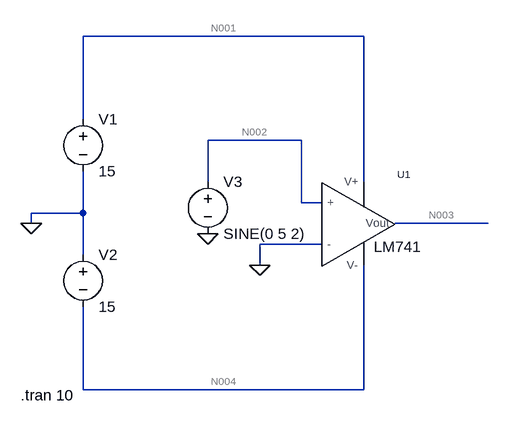
[diagram p0: schematic comparator.asc]
comparator.asc, the LTspice schematic file:
Version 4.1
SHEET 1 880 680
WIRE 224 -144 -208 -144
WIRE -208 -16 -208 -144
WIRE 128 16 -16 16
WIRE -16 80 -16 16
WIRE 224 80 224 -144
WIRE 128 112 128 16
WIRE 160 112 128 112
WIRE -208 128 -208 64
WIRE -208 128 -288 128
WIRE -288 144 -288 128
WIRE 416 144 272 144
WIRE 160 176 64 176
WIRE -208 192 -208 128
WIRE 64 208 64 176
WIRE -208 400 -208 272
WIRE 224 400 224 208
WIRE 224 400 -208 400
FLAG -288 144 0
FLAG 64 208 0
FLAG -16 160 0
SYMBOL LM\ 741\\LM741 208 160 R0
WINDOW 3 69 4 Top 2
SYMATTR InstName U1
SYMBOL voltage -208 -32 R0
WINDOW 123 0 0 Left 0
WINDOW 39 0 0 Left 0
SYMATTR InstName V1
SYMATTR Value 15
SYMBOL voltage -208 176 R0
WINDOW 123 0 0 Left 0
WINDOW 39 0 0 Left 0
SYMATTR InstName V2
SYMATTR Value 15
SYMBOL voltage -16 64 R0
WINDOW 123 0 0 Left 0
WINDOW 39 0 0 Left 0
SYMATTR InstName V3
SYMATTR Value SINE(0 5 2)
TEXT -304 408 Left 2 !.tran 10

The netlist it stands for:
* comparator.asc
X§U1 N002 0 N001 N004 N003 LM741  ; pins + - V+ V- Vout
V1 N001 0 15
V2 0 N004 15
V3 N002 0 SINE(0 5 2)
.tran 10
.lib C:\Users\Subodha\Desktop\Desk\2nd Semester\Electronics\LT Spices\Unity gain amplifier\LM 741\lm741.lib
.backanno
.end

* Results of the author's LTspice run, read from the files saved beside the schematic
* Operating Point, zero values left out:
*   V(n001) = 15 V
*   V(n003) = 13.92 V
*   V(n004) = -15 V
*   I(V1) = -1.701 mA
*   I(V2) = -1.701 mA
*   I(V3) = -61.4 nA
*   Ix(u1:1) = 61.4 nA
*   Ix(u1:2) = 98.31 nA
*   Ix(u1:99) = 1.701 mA
*   Ix(u1:50) = -1.701 mA
*   Ix(u1:28) = -1.776 pA
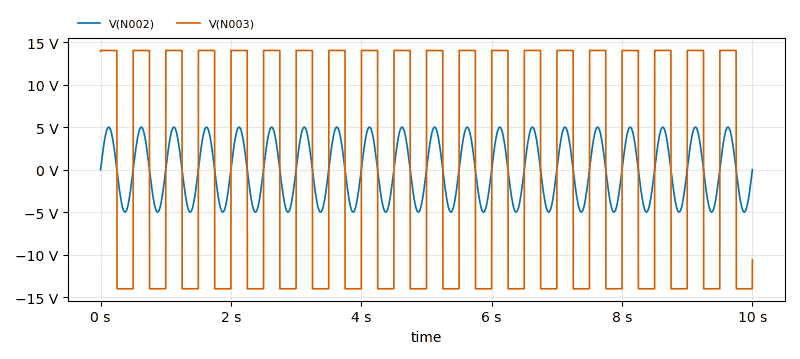
[diagram p1: Transient Analysis of comparator.asc, plotted from the saved traces]
* Transient Analysis, 1 run:
*   V(N002): min -5 V, max 5 V, average -10.23 µV, rms 3.535 V, last 0 V
*   V(N003): min -14.03 V, max 14.04 V, average 2.767 mV, rms 14.02 V, last -10.63 V